# Altium schematic sheet Schematic.SchDoc: ADS1115 module
size A; Date: 10/9/2020; Author: AmirHoseinYousefi; CompanyName: Texas instrument; DocumentNumber: 1; Revision: 1; SheetNumber: 1; SheetTotal: 1; Time: 10:43
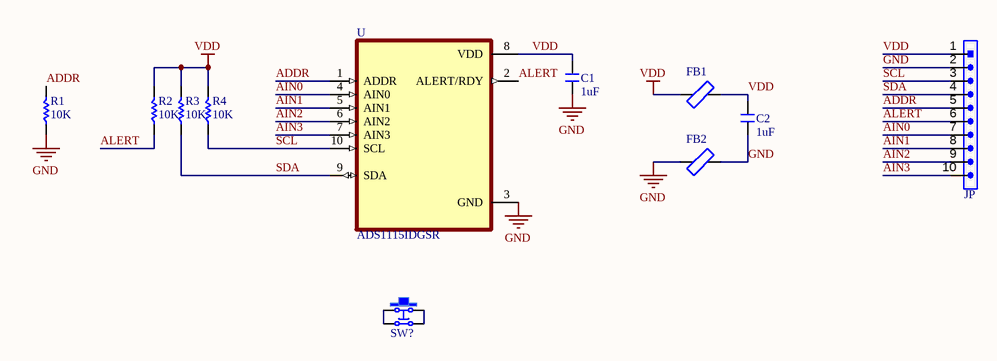
[diagram p0: Schematic.SchDoc]

## Parts
C1  1uF  [C 0805]
C2  1uF  [C 0805]
FB1  (no value)  [F 0805]
FB2  (no value)  [F 0805]
JP  HDR-1X10  [HDR-1X10]  (value not drawn)
R1  10K  [R 0805]
R2  10K  [R 0805]
R3  10K  [R 0805]
R4  10K  [R 0805]
SW?  6x6x5  [TSW DIP-6*6*9]  (value not drawn)
U  ADS1115IDGSR  [SOP50P490X110-10N]

## Nets
GND: C1.1 C2.1 FB2.1 FB2.2 JP.2 R1.1 U.3(GND)
VDD: C1.2 C2.2 FB1.1 FB1.2 JP.1 R2.2 R3.2 R4.2 U.8(VDD)
ADDR: JP.5 R1.2 U.1(ADDR)
AIN0: JP.7 U.4(AIN0)
AIN1: JP.8 U.5(AIN1)
AIN2: JP.9 U.6(AIN2)
AIN3: JP.10 U.7(AIN3)
ALERT: JP.6 R2.1 U.2(ALERT/RDY)
SCL: JP.3 R4.1 U.10(SCL)
SDA: JP.4 R3.1 U.9(SDA)
NetSW?_1: SW?.1 SW?.2
NetSW?_3: SW?.3 SW?.4

## Library data of the parts
C1 C2 = C: Non-polar patch capacitor; BOM名称: 无极性贴片电容; 版权归属: 源创客; 学习资源: www.ooocke.com
FB1 FB2 = FB: Ferrite Bead; BOM名称: 贴片电阻; 版权归属: 源创客; 学习资源: www.ooocke.com
JP = Header 10: 10P Connector; BOM名称: 10P接插件; 版权归属: 源创客; 学习资源: www.ooocke.com
R1-R4 = R: Chip resistor; 版权归属: 源创客; BOM名称: Chip resistor; 学习资源: www.ooocke.com
SW? = TSW DIP-6x6: Straight plug 6x6 tact switch; BOM名称: 直插6x6轻触开关; 版权归属: 源创客; 学习资源: www.ooocke.com
U = ADS1115IDGSR: 16-Bit 860SPS 4-Ch Delta-Sigma ADC With PGA, Oscillator, Vref, Comparator, and I2C 10-VSSOP -40 to 125; MF: Texas Instruments; SnapEDA_Link: https://www.snapeda.com/parts/ADS1115IDGSR/Texas%20Instruments/view-part/45903/?ref=snap; Value: *; Texas_Instruments-Purchase-URL: https://snapeda.com/shop?store=Texas+Instruments&id=45903; Price: None; Availability: Good; Mouser-Purchase-URL: https://snapeda.com/shop?store=Mouser&id=45903; MP: ADS1115IDGSR; Package: VSSOP-10 Texas Instruments; DigiKey-Purchase-URL: https://snapeda.com/shop?store=DigiKey&id=45903; BuyPart: https://www.snapeda.com/parts/ADS1115IDGSR/Texas%20Instruments/view-part/45903/?ref=eda